# Altium schematic sheet Spindle_Sync.SchDoc
size B; Author: AM; CompanyName: Expatria Technologies; DrawnBy: A.Marles; Engineer: AM; Organization: Expatria Technologies; DocumentNumber: 12; Revision: A1; SheetNumber: 12; SheetTotal: 14; PCB_Rev: A1
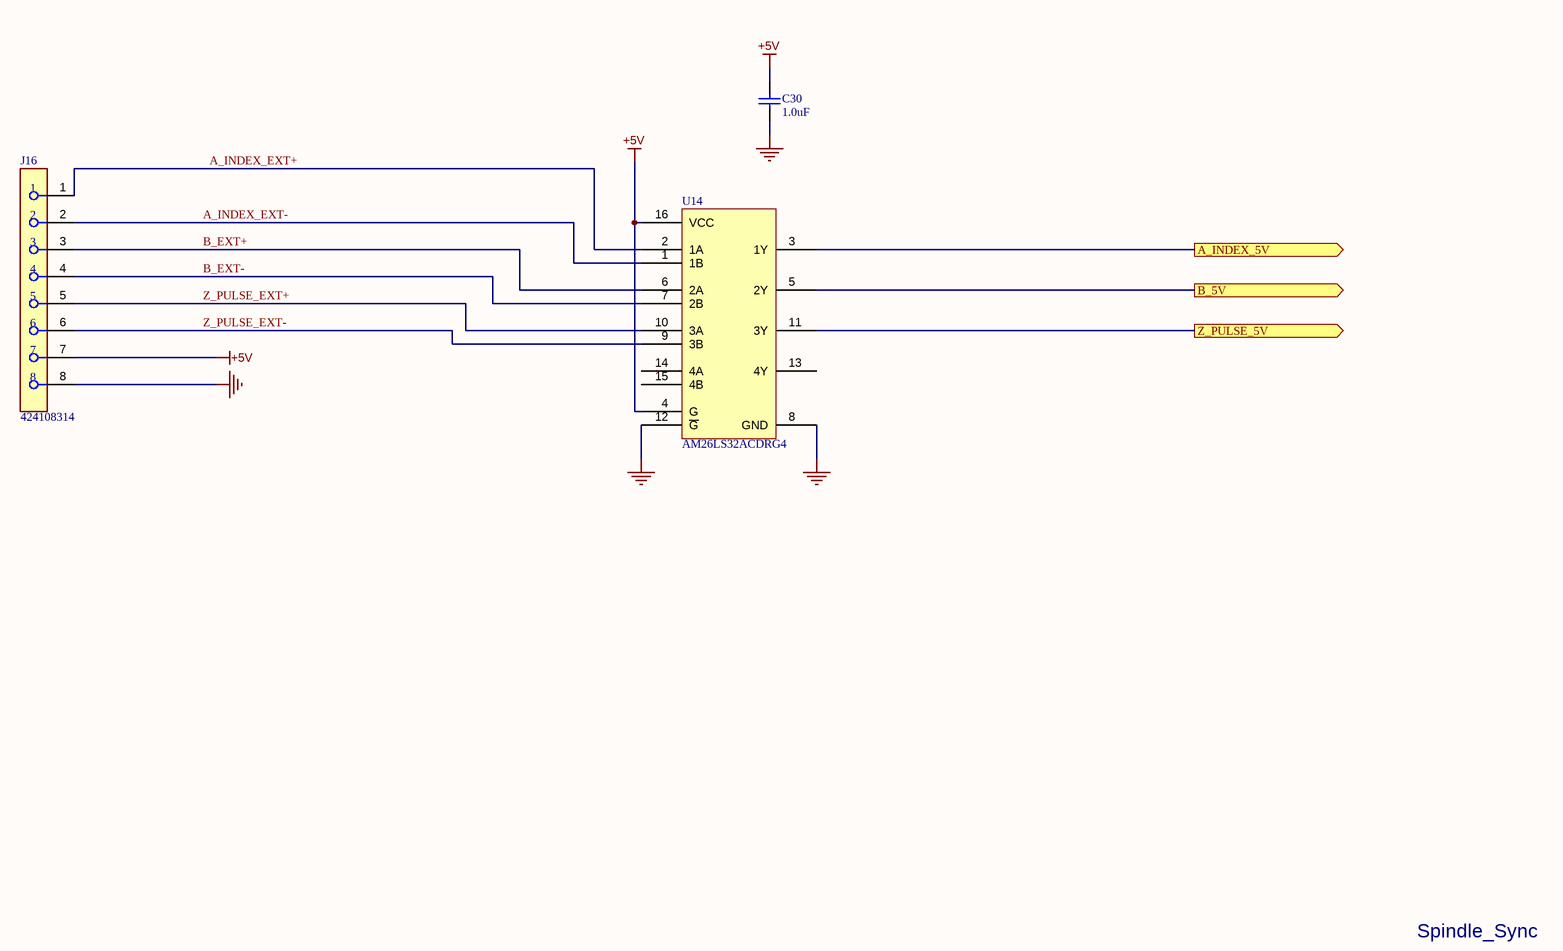
[diagram p0: Spindle_Sync.SchDoc]

## Parts
C30  1.0uF  [0402_C]
J16  424108314  [FP-5555799-1-MFG]
U14  AM26LS32ACDRG4  [SOIC-16_150mil]

## Ports
A_INDEX_5V (out), B_5V (out), Z_PULSE_5V (out)

## Nets
+5V: C30.2 J16.7 U14.4(G) U14.16(VCC)
GND: C30.1 J16.8 U14.8(GND) U14.12(~{G})
A_INDEX_5V: U14.3(1Y) ; port A_INDEX_5V
A_INDEX_EXT+: J16.1 U14.2(1A)
A_INDEX_EXT-: J16.2 U14.1(1B)
B_5V: U14.5(2Y) ; port B_5V
B_EXT+: J16.3 U14.6(2A)
B_EXT-: J16.4 U14.7(2B)
Z_PULSE_5V: U14.11(3Y) ; port Z_PULSE_5V
Z_PULSE_EXT+: J16.5 U14.10(3A)
Z_PULSE_EXT-: J16.6 U14.9(3B)

Not connected (* = marked no-connect by the designer): U14 13(4Y) 14(4A) 15(4B)

## Notes on the sheet
- Spindle_Sync
- SHEET
- Expatria Technologies
- 1136 Glade Court
- Port Coquitlam, BC V3B 1R5
- PROJECT
- SIZE
- ENGR
- MODIFIED
- DOCUMENT
- REV
- Copyright Expatria Technologies 2021.  This document describes Open Hardware and is licensed under the CERN-OHL-P  v2.  No warranty is implied or expressed.
- EMAIL: INFO@EXPATRIA.CA
- B
- /

## Library data of the parts
C30 = 0402 1.0uF (105) 10% 25V: Chip capacitor; Manufacturer: Samsung Electro-Mechanics; PartNumber: CL05A105KA5NQNC; Capacitance: 1uF; Tolerance: 10%; Voltage: 25V; Package: 0402; Supplier: LC; SuppliersPartNumber: C52923
J16 = CMP-03371-000003-1: CONN MOD JACK 8P8C VERT UNSHLD; SuppliersPartNumber: C563815; Supplier: LCSC
U14 = AM26LS32ACDRG4_[C6180]: 接口芯片; Package: SOIC-16_150mil; Supplier: LC; SuppliersPartNumber: C6180